# EAGLE design midicontroller (EAGLE 7.0.0)
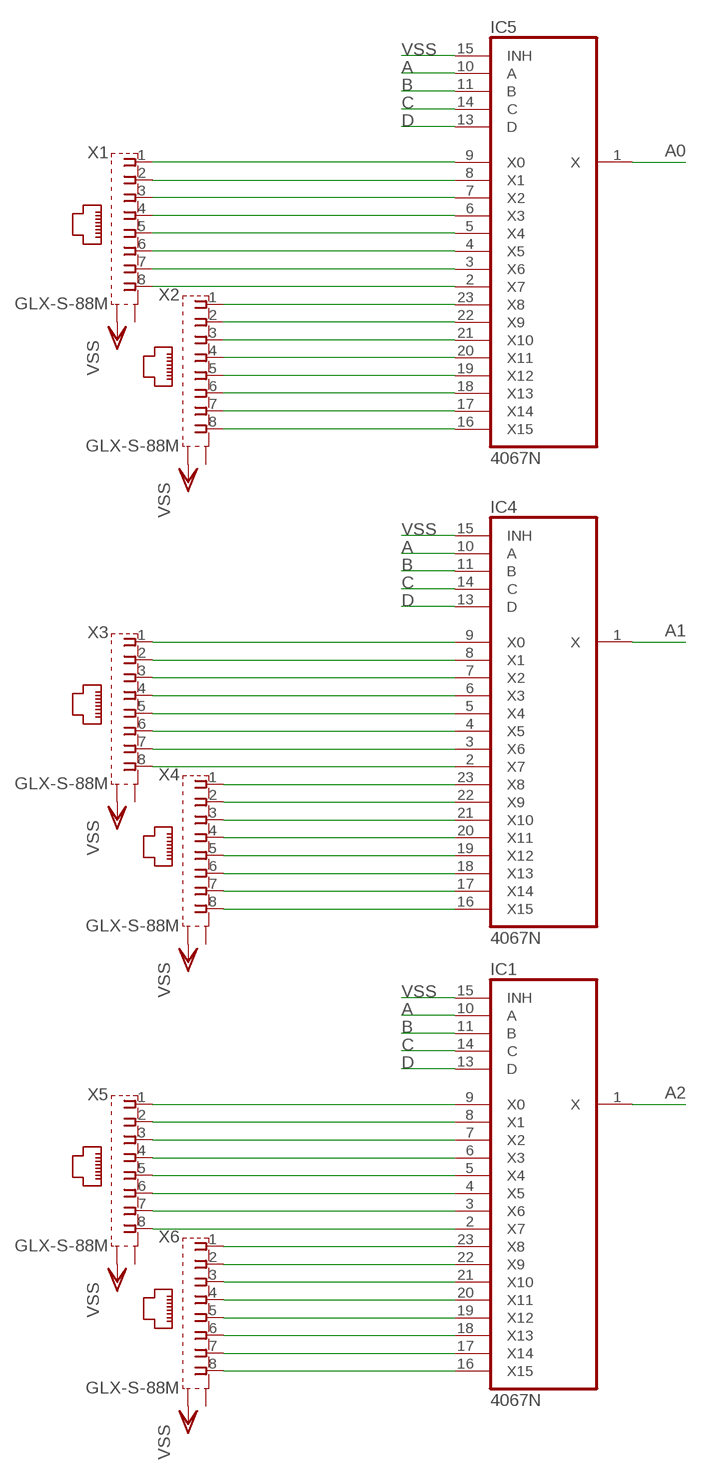
[diagram p0: schematic, sheet 1]

## Parts
IC1  4067N  [DIL24-6]
IC4  4067N  [DIL24-6]
IC5  4067N  [DIL24-6]
X1  GLX-S-88M  [GLX-S-88M]
X2  GLX-S-88M  [GLX-S-88M]
X3  GLX-S-88M  [GLX-S-88M]
X4  GLX-S-88M  [GLX-S-88M]
X5  GLX-S-88M  [GLX-S-88M]
X6  GLX-S-88M  [GLX-S-88M]

## Nets
A: IC1.10(A) IC4.10(A) IC5.10(A)
A0: IC5.1(X)
A1: IC4.1(X)
A2: IC1.1(X)
B: IC1.11(B) IC4.11(B) IC5.11(B)
C: IC1.14(C) IC4.14(C) IC5.14(C)
D: IC1.13(D) IC4.13(D) IC5.13(D)
N$1: IC5.8(X1) X1.2
N$2: IC5.7(X2) X1.3
N$3: IC5.6(X3) X1.4
N$4: IC5.5(X4) X1.5
N$5: IC5.4(X5) X1.6
N$6: IC5.3(X6) X1.7
N$7: IC5.2(X7) X1.8
N$8: IC5.23(X8) X2.1
N$9: IC5.22(X9) X2.2
N$10: IC5.21(X10) X2.3
N$11: IC5.20(X11) X2.4
N$12: IC5.19(X12) X2.5
N$13: IC5.18(X13) X2.6
N$14: IC5.17(X14) X2.7
N$15: IC5.16(X15) X2.8
N$16: IC4.9(X0) X3.1
N$17: IC4.8(X1) X3.2
N$18: IC4.7(X2) X3.3
N$19: IC4.6(X3) X3.4
N$20: IC4.5(X4) X3.5
N$21: IC4.4(X5) X3.6
N$22: IC4.3(X6) X3.7
N$23: IC4.2(X7) X3.8
N$24: IC4.23(X8) X4.1
N$25: IC4.22(X9) X4.2
N$26: IC4.21(X10) X4.3
N$27: IC4.20(X11) X4.4
N$28: IC4.19(X12) X4.5
N$29: IC4.18(X13) X4.6
N$30: IC4.17(X14) X4.7
N$31: IC4.16(X15) X4.8
N$32: IC1.9(X0) X5.1
N$33: IC1.8(X1) X5.2
N$34: IC1.7(X2) X5.3
N$35: IC1.6(X3) X5.4
N$36: IC1.5(X4) X5.5
N$37: IC1.4(X5) X5.6
N$38: IC1.3(X6) X5.7
N$39: IC1.2(X7) X5.8
N$40: IC1.23(X8) X6.1
N$41: IC1.22(X9) X6.2
N$42: IC1.21(X10) X6.3
N$43: IC1.20(X11) X6.4
N$44: IC1.19(X12) X6.5
N$45: IC1.18(X13) X6.6
N$46: IC1.17(X14) X6.7
N$47: IC1.16(X15) X6.8
N$79: IC5.9(X0) X1.1
VSS: IC1.15(INH) IC4.15(INH) IC5.15(INH) X1.S2 X2.S2 X3.S2 X4.S2 X5.S2 X6.S2
Unconnected: X1.S1 X2.S1 X3.S1 X4.S1 X5.S1 X6.S1

## Power pins joined to a net without a drawn wire
VDD: IC1.24(VDD) IC4.24(VDD) IC5.24(VDD)
VSS: IC1.12(VSS) IC4.12(VSS) IC5.12(VSS)

## Library data of the parts
IC1 IC4 IC5 = 40xx:4067: 16-channel ANALOG MULTIPLEXER
X1-X6 = con-kycon:GLX-S-88M: Mod. Jack, Right Angle, 8 posiotion, 8 contatcs RJ45 Source: GLX-S-88M.pdf; OC_FARNELL: unknown; OC_NEWARK: unknown

## Board
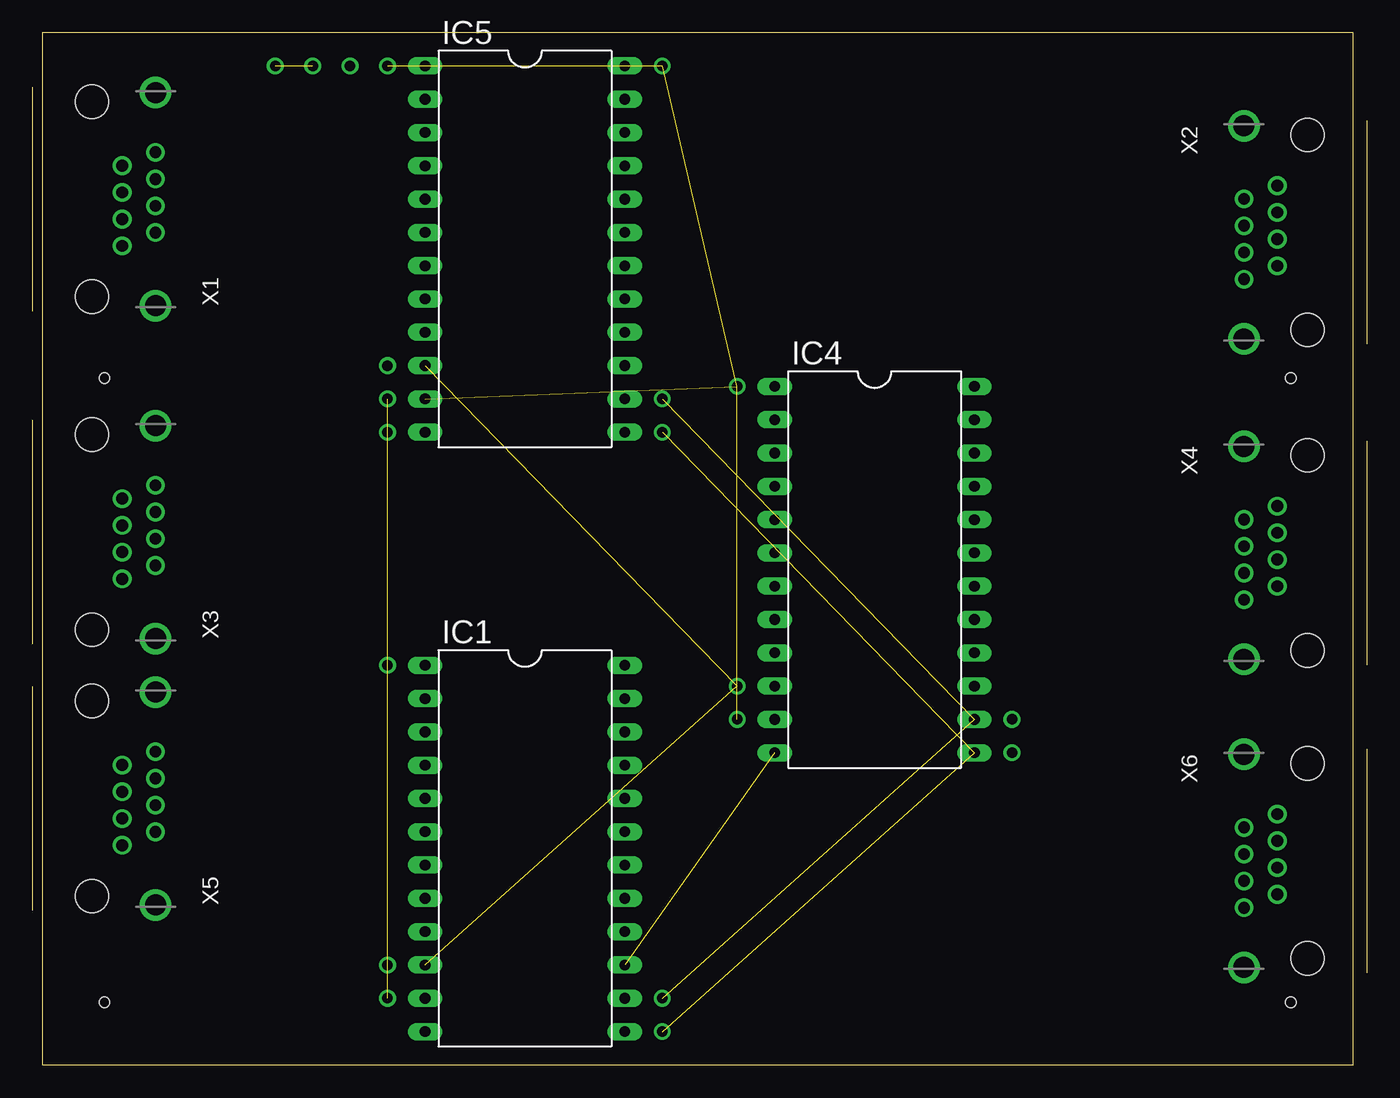
[diagram p1: board, top side]
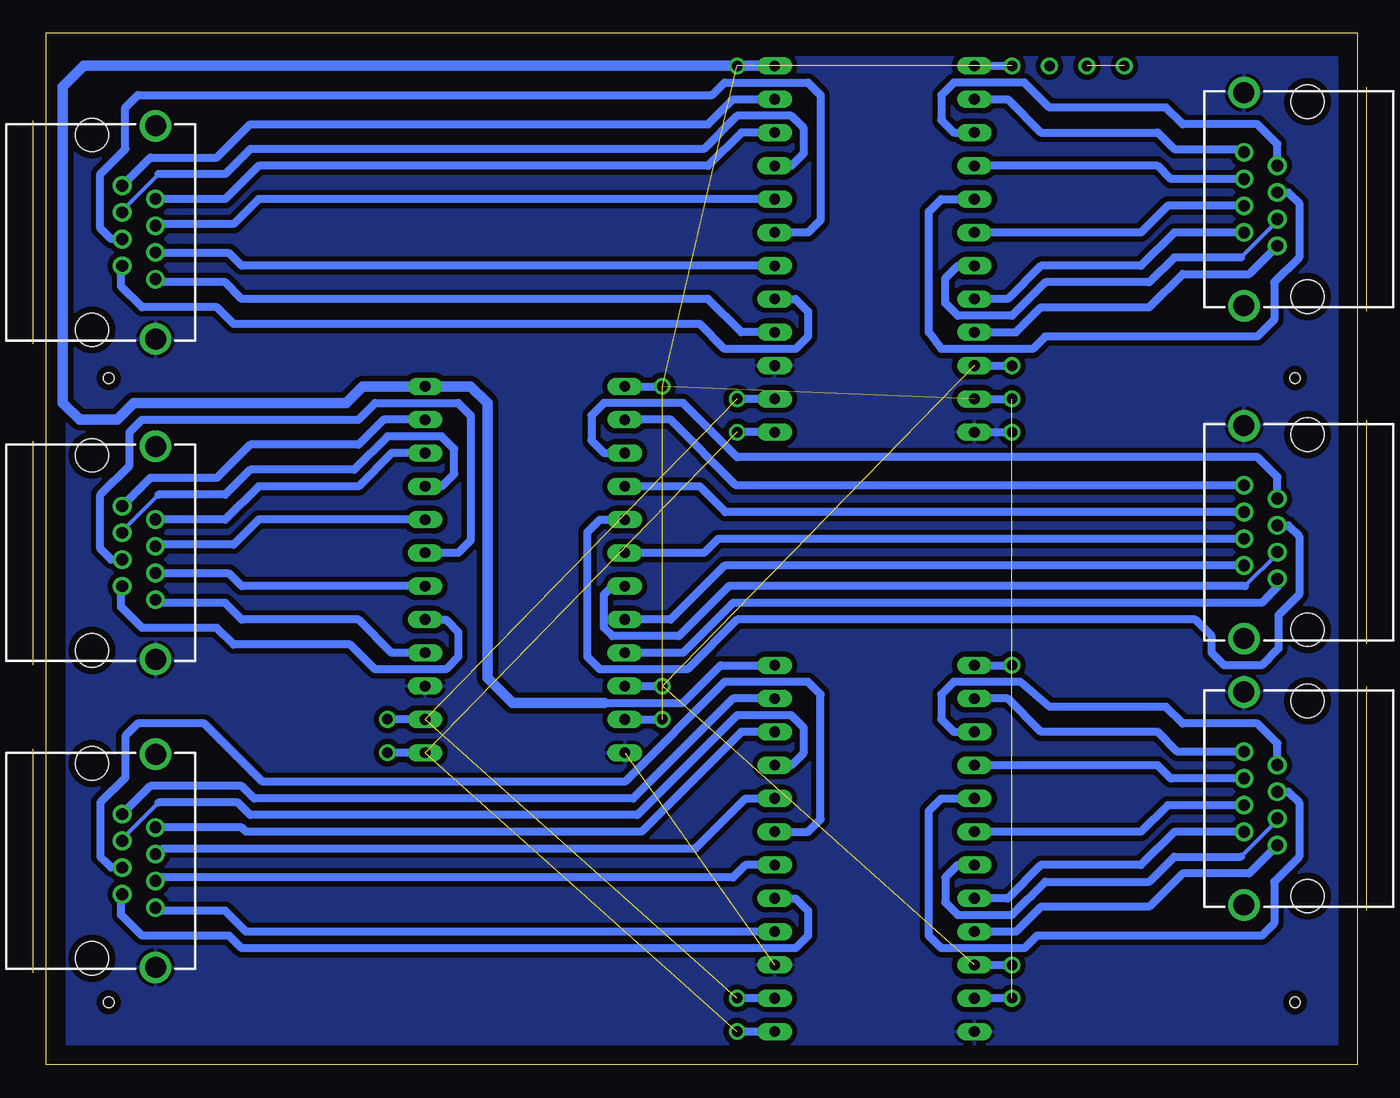
[diagram p2: board, bottom side, seen from below]

Size 100 x 78.73 mm. Coordinates in mm from the lower left corner, seen from the top.
Outline: 0,0 100,0 100,78.73 0,78.73 0,0
Copper layers (1*16): Top 0.035mm / dielectric 1.5mm / Bottom 0.035mm
Design rules "Tkkrlab-CNC-old *": minimum track width 8mil, minimum drill 0.7mm, track to track 0.37mm, track to pad 0.3mm, pad to pad 0.37mm, via to via 0.37mm, smd to smd 0.37mm, copper to edge 20mil, drill to drill 8mil, minimum pad ring 10mil, minimum via ring 8mil, stop-mask expansion 4mil, vias tented up to drill 0mil, thermal gap 10mil
Holes 0.8 mm at 4.76,4.76 95.25,4.76 4.76,52.39 95.25,52.39

### Footprints (pad centres in the part's own frame; a part is rotated, then mirrored left to right if it is on the bottom)
DIL24-6 = drill 0.813 long: 1 -13.97,-7.62; 2 -11.43,-7.62; 3 -8.89,-7.62; 4 -6.35,-7.62; 5 -3.81,-7.62; 6 -1.27,-7.62; 7 1.27,-7.62; 8 3.81,-7.62; 9 6.35,-7.62; 10 8.89,-7.62; 11 11.43,-7.62; 12 13.97,-7.62; 13 13.97,7.62; 14 11.43,7.62; 15 8.89,7.62; 16 6.35,7.62; 17 3.81,7.62; 18 1.27,7.62; 19 -1.27,7.62; 20 -3.81,7.62; 21 -6.35,7.62; 22 -8.89,7.62; 23 -11.43,7.62; 24 -13.97,7.62
GLX-S-88M = drill 0.9 pad 1.422: 1 -3.57,-2.3; 2 -2.55,-4.84; 3 -1.53,-2.3; 4 -0.51,-4.84; 5 0.51,-2.3; 6 1.53,-4.84; 7 2.55,-2.3; 8 3.57,-4.84 | drill 1.6 pad 2.184: S1 -8.125,-4.84; S2 8.125,-4.84 | hole 2.55: -7.44,0; 7.44,0

### Placement (x,y rotation side)
IC1  36.83,16.51 270 top
IC4  63.5,37.78 270 top
IC5  36.83,62.23 270 top
X1  3.81,66.04 90 top
X2  96.52,63.5 270 top
X3  3.81,40.64 90 top
X4  96.52,39.05 270 top
X5  3.81,20.32 90 top
X6  96.52,15.56 270 top

### Tracks (layer width: path | path; a pad name or v marks a point on that pad's centre or on a via)
A  (via drill 0.8 pad 1.27)  (2 unrouted)
  Bottom 0.61: IC1.10 v26.35,7.62 | IC4.10 v53.02,28.89 | IC5.10 v26.35,53.34
A0
  Bottom 0.61: IC5.1 26.35,76.2
A1
  Bottom 0.61: IC4.1 53.02,51.75
A2
  Bottom 0.61: IC1.1 26.35,30.48
B  (via drill 0.8 pad 1.27)  (7 unrouted)
  Bottom 0.61: v26.35,5.08 IC1.11 | IC4.11 v53.02,26.35 | IC5.11 v26.35,50.8
  other vias: 26.35,30.48 53.02,51.75 26.35,76.2 26.35,48.26 47.31,76.2
C  (via drill 0.8 pad 1.27)  (2 unrouted)
  Bottom 0.61: IC1.14 v47.31,5.08 | IC4.14 v73.98,26.35 | IC5.14 v47.31,50.8
D  (via drill 0.8 pad 1.27)  (2 unrouted)
  Bottom 0.61: IC1.13 v47.31,2.54 | IC4.13 v73.98,23.81 | IC5.13 v47.31,48.26
N$1
  Bottom 0.61: X1.2 13.98,63.49 16.51,60.96 24.13,60.96 26.67,58.42 IC5.8
N$2
  Bottom 0.305: X1.3 6.11,64.38 8.89,61.59
  Bottom 0.61: 8.89,61.59 13.97,61.59 15.88,59.69 23.81,59.69 26.35,57.15 30.48,57.15 31.43,58.1 31.43,60.01 30.48,60.96 IC5.7
N$3
  Bottom 0.61: X1.4 14.48,65.53 16.51,63.5 IC5.6
N$4
  Bottom 0.61: X1.5 5.27,66.55 4.45,65.72 4.45,61.59 6.35,59.69 6.35,56.83 7.62,55.56 23.81,55.56 24.77,54.61 31.75,54.61 32.7,55.88 32.7,65.09 31.75,66.04 IC5.5
N$5
  Bottom 0.61: X1.6 14.23,67.57 15.24,68.58 IC5.4
N$6
  Bottom 0.61: X1.7 6.11,70.25 7.62,71.75 13.34,71.75 14.61,73.03 23.5,73.03 25.4,74.93 30.8,74.93 31.75,73.98 31.75,72.07 30.8,71.12 IC5.3
N$7
  Bottom 0.61: IC5.2 26.67,73.66 24.13,71.12 15.24,71.12 13.97,69.85 8.89,69.85 X1.8
N$8
  Bottom 0.61: X2.1 92.08,69.22 87,69.22 84.45,71.75 49.53,71.75 47.62,73.66 IC5.23
N$9
  Bottom 0.61: IC5.22 46.99,71.12 49.53,68.58 83.82,68.58 86.36,66.04 X2.2
N$10
  Bottom 0.305: X2.3 94.22,65.17 91.44,67.94
  Bottom 0.61: IC5.21 43.18,68.58 42.23,69.53 42.23,71.44 43.18,72.39 47.31,72.39 49.85,69.85 84.45,69.85 86.36,67.94 91.44,67.94
N$11
  Bottom 0.61: IC5.20 83.82,66.04 85.72,64.14 91.56,64.14 X2.4
N$12
  Bottom 0.61: X2.5 95.06,62.99 95.89,63.82 95.89,67.94 93.98,69.85 93.98,73.03 93.03,73.98 49.21,73.98 48.26,74.93 41.91,74.93 40.96,73.98 40.96,64.45 41.91,63.5 IC5.19
N$13
  Bottom 0.61: IC5.18 85.09,60.96 86.04,61.91 91.62,61.91 X2.6
N$14
  Bottom 0.61: IC5.17 42.86,58.42 41.91,57.47 41.91,55.56 42.86,54.61 48.26,54.61 50.16,56.52 85.72,56.52 87,57.78 92.71,57.78 94.3,59.37 94.3,60.87 X2.7
N$15
  Bottom 0.61: IC5.16 46.99,55.88 49.53,58.42 85.09,58.42 86.36,59.69 91.44,59.69 X2.8
N$16
  Bottom 0.61: X3.1 6.11,36.44 7.3,35.24 47.62,35.24 51.44,31.43 IC4.9
N$17
  Bottom 0.61: X3.2 48.27,38.09 52.39,33.97 IC4.8
N$18
  Bottom 0.305: X3.3 6.11,38.98 8.57,36.51
  Bottom 0.61: 8.57,36.51 47.94,36.51 51.75,32.7 56.83,32.7 57.47,33.34 57.47,35.88 56.83,36.51 IC4.7
N$19
  Bottom 0.61: X3.4 48.77,40.13 49.85,39.05 IC4.6
N$20
  Bottom 0.61: X3.5 5.27,41.15 4.45,40.32 4.45,35.88 6.03,34.29 6.03,31.75 7.3,30.48 10.16,30.48 11.11,31.43 11.11,32.7 12.38,33.97 47.31,33.97 51.12,30.16 57.78,30.16 58.74,31.11 58.74,40.64 57.78,41.59 IC4.5
N$21
  Bottom 0.61: X3.6 48.2,42.17 50.16,44.13 IC4.4
N$22
  Bottom 0.61: X3.7 6.11,44.84 7.62,46.35 47.31,46.35 51.44,50.48 57.47,50.48 58.42,49.53 58.42,47.62 57.47,46.67 IC4.3
N$23
  Bottom 0.61: X3.8 47.38,44.21 52.39,49.21 IC4.2
N$24
  Bottom 0.61: IC4.23 74.3,49.21 76.2,47.31 84.45,47.31 87,44.77 92.08,44.77 X4.1
N$25
  Bottom 0.61: IC4.22 73.66,46.67 76.2,44.13 83.82,44.13 86.36,41.59 X4.2
N$26
  Bottom 0.305: X4.3 94.22,40.72 91.44,43.5
  Bottom 0.61: IC4.21 69.85,44.13 68.9,45.09 68.9,46.99 69.85,47.94 73.98,47.94 76.52,45.4 84.45,45.4 86.36,43.5 91.44,43.5
N$27
  Bottom 0.61: IC4.20 83.82,41.59 85.72,39.69 91.56,39.69 X4.4
N$28
  Bottom 0.61: X4.5 95.06,38.54 95.89,39.37 95.89,43.5 93.66,45.72 93.66,48.26 92.71,49.21 76.2,49.21 74.93,50.48 68.58,50.48 67.63,49.53 67.63,40.01 68.58,39.05 IC4.19
N$29
  Bottom 0.61: IC4.18 85.09,36.51 86.04,37.47 91.62,37.47 X4.6
N$30
  Bottom 0.61: IC4.17 69.53,33.97 68.58,33.02 68.58,31.11 69.53,30.16 74.93,30.16 76.83,32.07 85.72,32.07 87,33.34 92.71,33.34 94.3,34.92 94.3,36.42 X4.7
N$31
  Bottom 0.61: IC4.16 73.66,31.43 76.2,33.97 85.09,33.97 86.36,35.24 91.44,35.24 X4.8
N$32
  Bottom 0.61: X5.1 8.26,14.61 13.34,14.61 15.88,12.06 24.13,12.06 26.04,10.16 IC1.9
N$33
  Bottom 0.61: X5.2 13.98,17.77 16.51,15.24 24.13,15.24 26.67,12.7 IC1.8
N$34
  Bottom 0.305: X5.3 6.11,18.66 8.89,15.88
  Bottom 0.61: IC1.7 30.48,15.24 31.43,14.29 31.43,12.38 30.48,11.43 26.35,11.43 23.81,13.97 15.88,13.97 13.97,15.88 8.89,15.88
N$35
  Bottom 0.61: X5.4 14.48,19.81 16.51,17.78 IC1.6
N$36
  Bottom 0.61: X5.5 5.27,20.83 4.45,20 4.45,15.88 6.35,13.97 6.35,10.79 7.3,9.84 24.45,9.84 25.4,8.89 31.75,8.89 32.7,9.84 32.7,19.37 31.75,20.32 IC1.5
N$37
  Bottom 0.61: X5.6 14.23,21.85 15.24,22.86 IC1.4
N$38
  Bottom 0.61: X5.7 6.11,24.52 7.62,26.04 13.34,26.04 14.61,27.3 23.5,27.3 25.72,29.21 30.8,29.21 31.75,28.26 31.75,26.35 30.8,25.4 IC1.3
N$39
  Bottom 0.61: X5.8 13.73,23.89 15.24,25.4 24.13,25.4 26.67,27.94 IC1.2
N$40
  Bottom 0.61: IC1.23 47.62,27.94 55.24,20.32 84.14,20.32 85.09,21.27 92.08,21.27 X6.1
N$41
  Bottom 0.61: IC1.22 46.99,25.4 54.61,17.78 84.77,17.78 85.09,18.1 91.67,18.1 X6.2
N$42
  Bottom 0.305: X6.3 94.22,17.22 91.44,20
  Bottom 0.61: IC1.21 43.18,22.86 42.23,23.81 42.23,25.72 43.18,26.67 47.31,26.67 54.93,19.05 84.45,19.05 85.41,20 91.44,20
N$43
  Bottom 0.61: X6.4 91.56,16.07 91.12,16.51 50.48,16.51 46.67,20.32 IC1.20
N$44
  Bottom 0.61: X6.5 95.06,15.05 95.57,15.56 95.89,15.88 95.89,20 93.98,21.91 93.98,25.08 93.03,26.04 87.95,26.04 83.5,21.59 55.88,21.59 48.26,29.21 41.91,29.21 40.96,28.26 40.96,18.73 41.91,17.78 IC1.19
N$45
  Bottom 0.61: IC1.18 46.67,15.24 47.62,14.29 91.42,14.29 X6.6
N$46
  Bottom 0.61: IC1.17 42.86,12.7 41.91,11.75 41.91,9.84 42.86,8.89 85.09,8.89 86.04,9.84 92.71,9.84 94.3,11.43 94.3,12.93 X6.7
N$47
  Bottom 0.61: IC1.16 84.77,10.16 86.36,11.75 91.44,11.75 X6.8
N$79
  Bottom 0.61: IC5.9 26.04,55.88 24.13,57.78 15.88,57.78 13.34,60.33 8.26,60.33 X1.1
N$80  (via drill 0.8 pad 1.27)  (1 unrouted)
  other vias: 20.64,76.2 17.78,76.2
N$81  (via drill 0.8 pad 1.27)
  other vias: 23.5,76.2
VDD
  Bottom 0.61: 57.47,27.62 51.44,27.62 48.58,30.48 IC1.24
  Bottom 0.813: 57.47,27.62 64.45,27.62 66.36,29.53 66.36,50.48 67.63,51.75 IC4.24 75.88,51.75 77.15,50.48 93.34,50.48 94.61,49.21 97.47,49.21 98.74,50.48 98.74,74.61 97.16,76.2 IC5.24
VSS  (1 unrouted)
  Bottom 0.61: IC5.12 26.35,48.26
  pour Bottom (isolate 0.406): 1.59,76.83 98.42,76.83 98.42,1.59 1.59,1.59